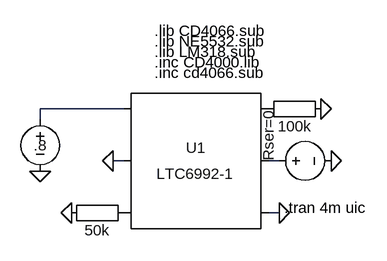
[diagram p0: schematic LTC6992-1_PWM_2_BARE_.asc]
LTC6992-1_PWM_2_BARE_.asc, the LTspice schematic file:
Version 4
SHEET 1 6068 1612
WIRE 800 -1504 672 -1504
WIRE 672 -1488 672 -1504
WIRE 800 -1424 784 -1424
WIRE 1040 -1424 1024 -1424
WIRE 1040 -1344 1024 -1344
FLAG 1120 -1424 0
FLAG 784 -1424 0
FLAG 720 -1344 0
FLAG 1104 -1504 0
FLAG 672 -1408 0
FLAG 1040 -1344 0
SYMBOL voltage 1024 -1424 R270
WINDOW 123 0 0 Left 2
WINDOW 39 0 0 Left 2
WINDOW 0 24 16 Invisible 2
WINDOW 3 24 96 Invisible 2
SYMATTR SpiceLine Rser=0
SYMATTR InstName V2
SYMATTR Value 5
SYMBOL Misc\\EuropeanResistor 704 -1360 M90
WINDOW 0 5 56 Invisible 2
WINDOW 3 27 56 VTop 2
SYMATTR InstName R9
SYMATTR Value 50k
SYMBOL Misc\\EuropeanResistor 1008 -1488 R270
WINDOW 0 27 56 Invisible 2
WINDOW 3 5 56 VBottom 2
SYMATTR InstName R1
SYMATTR Value 100k
SYMBOL SpecialFunctions\\LTC6992-1 912 -1424 R0
SYMATTR InstName U1
SYMBOL voltage 672 -1504 R0
WINDOW 0 24 16 Invisible 2
WINDOW 3 -10 56 Left 2
WINDOW 123 0 0 Left 2
SYMATTR InstName V1
SYMATTR Value .8
SYMATTR SpiceLine Rser=0
TEXT 1048 -1352 Left 2 !.tran 4m uic
TEXT 848 -1592 Left 2 !.lib LM318.sub
TEXT 848 -1624 Left 2 !.lib CD4066.sub
TEXT 848 -1576 Left 2 !.inc CD4000.lib
TEXT 848 -1560 Left 2 !.inc cd4066.sub
TEXT 848 -1608 Left 2 !.lib NE5532.sub

The netlist it stands for:
* LTC6992-1_PWM_2_BARE_.asc
V2 N002 0 5 Rser=0
R9 0 P001 50k
R1 P002 0 100k
XU1 N001 0 P001 0 N002 P002 LTC6992-1
V1 N001 0 .8 Rser=0
.tran 4m uic
.lib LM318.sub
.lib CD4066.sub
.inc CD4000.lib
.inc cd4066.sub
.lib NE5532.sub
.lib LTC6992-1.sub
.backanno
.end